# EAGLE design mbedshield060 (EAGLE 6.5.0)
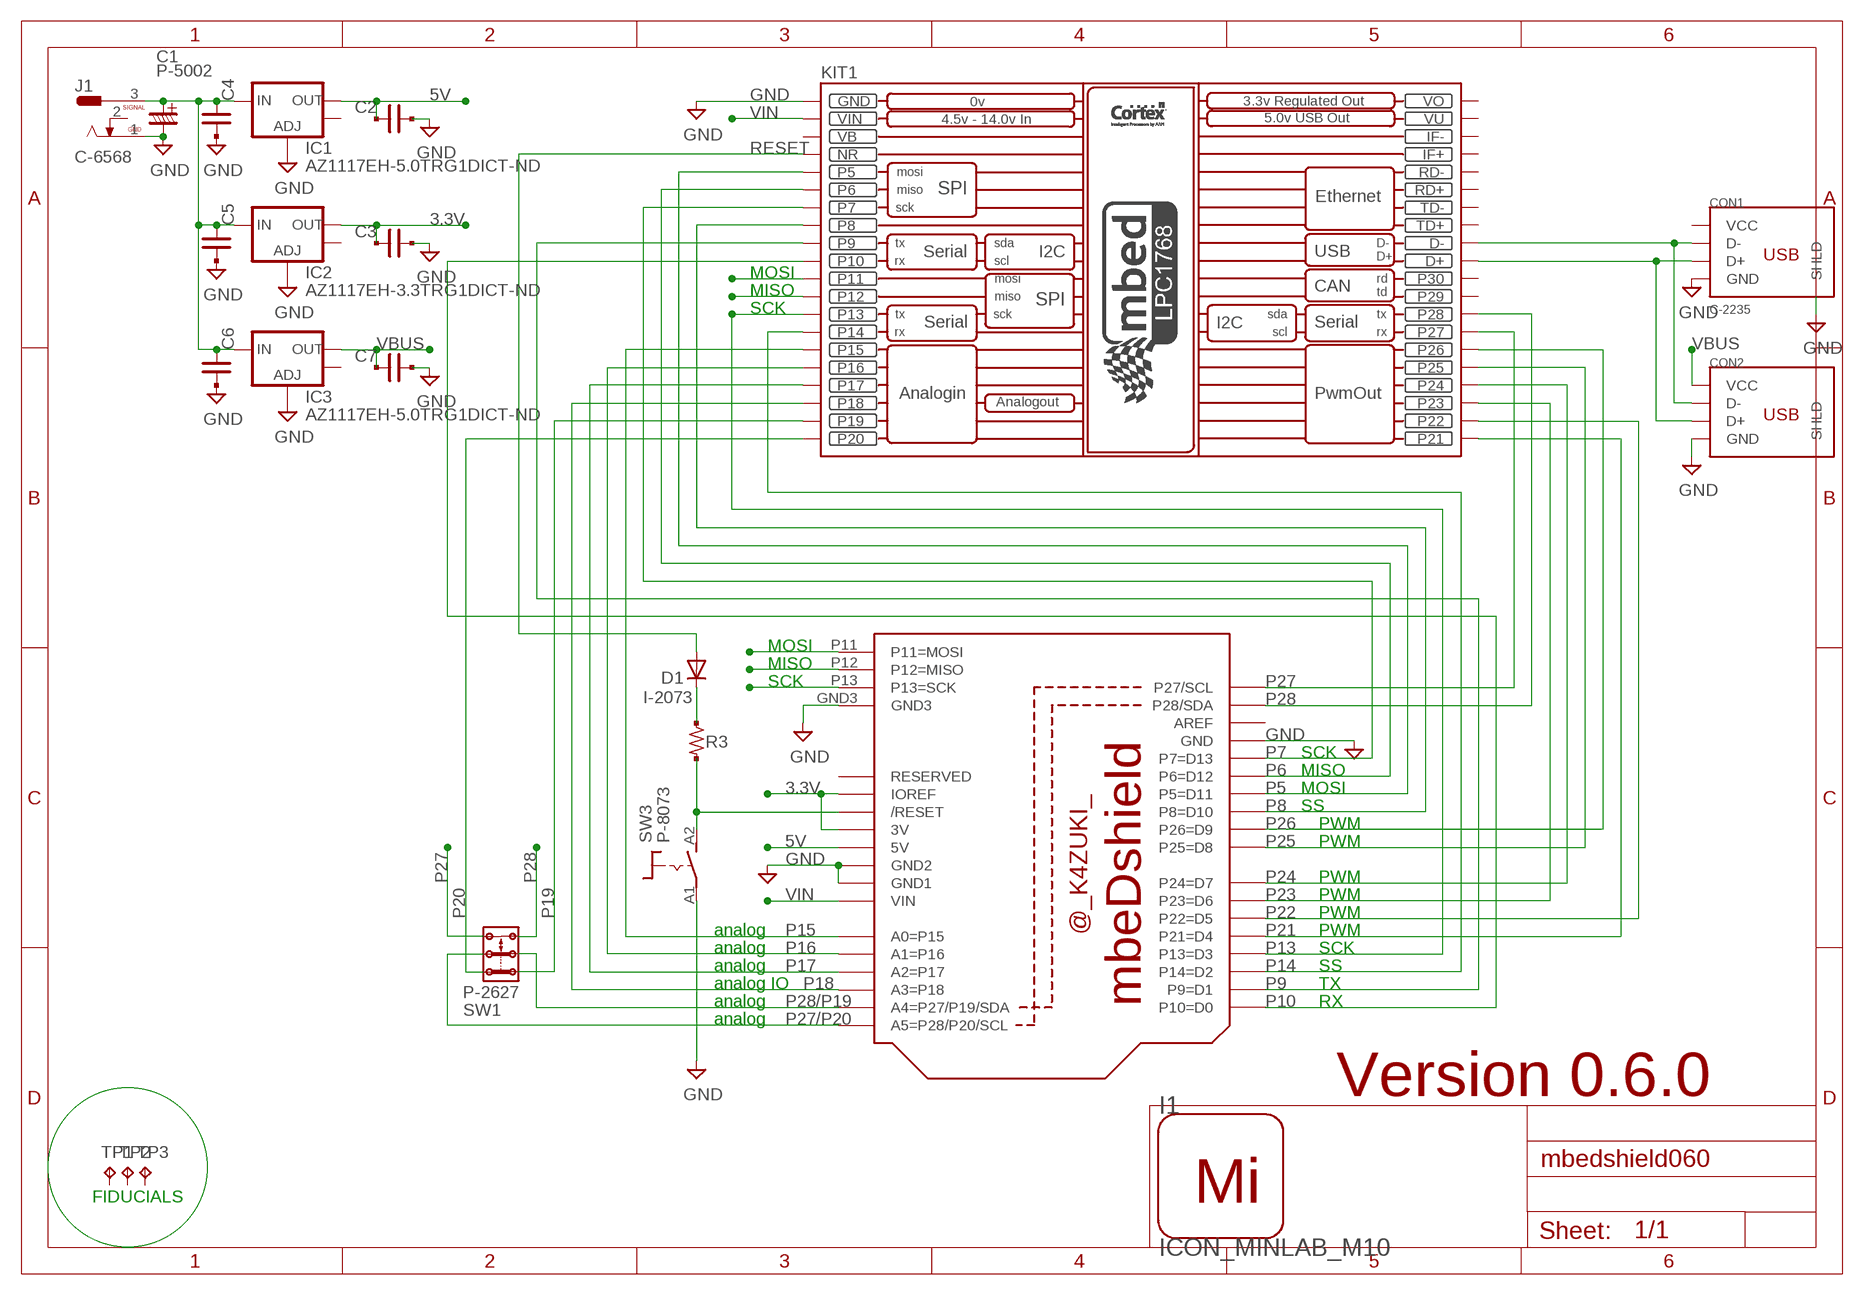
[diagram p0: schematic, sheet 1]

## Parts
C1  P-5002  C_DENKAI_2.5P6  [C_2.5PHI6]
C2  C_PAD_PAD_1608  [CR_1608]
C3  C_PAD_PAD_1608  [CR_1608]
C4  C_PAD_PAD_1608  [CR_1608]
C5  C_PAD_PAD_1608  [CR_1608]
C6  C_PAD_PAD_1608  [CR_1608]
C7  C_PAD_PAD_1608  [CR_1608]
CON1  C-2235  CON_USB  [CON_USB_MINIB_AKI]
CON2  CON_USB_A  [CON_USB_A_SHIELD]
D1  I-2073  DIODE_SMALL  [DIODE_2125]
I1  ICON_MINLAB_M10  [ICON_MINLAB_10MM]
IC1  AZ1117EH-5.0TRG1DICT-ND  V_REG_LM1117SOT223  [SOT223]
IC2  AZ1117EH-3.3TRG1DICT-ND  V_REG_LM1117SOT223  [SOT223]
IC3  AZ1117EH-5.0TRG1DICT-ND  V_REG_LM1117SOT223  [SOT223]
J1  C-6568  CON_DCJACK1  [CON_DCJACK]
KIT1  MBED_NXP_LPC1768  [MBED-KIT]
R3  R_US_PAD_PAD_1608  [R_1608_PADPAD]
SW1  P-2627  SW_SLIDESW_2_  [SW_SLIDE_2X2_1]
SW3  P-8073  SW_TACTSW_2PP8073  [SW_TACTSW_P8073]
TP1  TPTP20R  [TP20R]
TP2  TPTP20R  [TP20R]
TP3  TPTP20R  [TP20R]
U$1  mbeDshield060  BOARD_MBEDSHIELD3  [BOARD_MBEDSHIELD3]

## Nets
3.3V: C3.1 IC2.2(OUT) U$1.3V U$1.IOREF
5V: C2.1 IC1.2(OUT) U$1.5V
GND [power]: C1.- C2.2 C3.2 C4.2 C5.2 C6.2 C7.2 CON1.GND CON1.GND@1(SHLD) CON1.GND@2(SHLD) CON1.GND@3(SHLD) CON1.GND@4(SHLD) CON2.4(GND) IC1.1(ADJ) IC2.1(ADJ) IC3.1(ADJ) J1.1 KIT1.GND SW3.A1(P) U$1.GND U$1.GND1 U$1.GND2 U$1.GND3
N$1: CON1.D- CON2.2(D-) KIT1.D-
N$27: D1.K(C) R3.1
N$28: R3.2 SW3.A2(S) U$1.RESET(/RESET)
N$45: CON1.D+ CON2.3(D+) KIT1.D+
P5: KIT1.P$5(P5) U$1.D11(P5=D11)
P6: KIT1.P$6(P6) U$1.D12(P6=D12)
P7: KIT1.P$7(P7) U$1.D13(P7=D13)
P8: KIT1.P$8(P8) U$1.D10(P8=D10)
P9: KIT1.P$9(P9) U$1.D1(P9=D1)
P10: KIT1.P$10(P10) U$1.D0(P10=D0)
P11: KIT1.P$11(P11) U$1.P11(P11=MOSI)
P12: KIT1.P$12(P12) U$1.P12(P12=MISO)
P13: KIT1.P$13(P13) U$1.D3(P13=D3) U$1.P13(P13=SCK)
P14: KIT1.P$14(P14) U$1.D2(P14=D2)
P15: KIT1.P$15(P15) U$1.A0(A0=P15)
P16: KIT1.P$16(P16) U$1.A1(A1=P16)
P17: KIT1.P$17(P17) U$1.A2(A2=P17)
P18: KIT1.P$18(P18) U$1.A3(A3=P18)
P19: KIT1.P$19(P19) SW1.1.1
P20: KIT1.P$20(P20) SW1.1.2
P21: KIT1.P$21(P21) U$1.D4(P21=D4)
P22: KIT1.P$22(P22) U$1.D5(P22=D5)
P23: KIT1.P$23(P23) U$1.D6(P23=D6)
P24: KIT1.P$24(P24) U$1.D7(P24=D7)
P25: KIT1.P$25(P25) U$1.D8(P25=D8)
P26: KIT1.P$26(P26) U$1.D9(P26=D9)
P27: KIT1.P$27(P27) SW1.2.2 U$1.SCL(P27/SCL)
P27/P20: SW1.COM.2 U$1.A5(A5=P28/P20/SCL)
P28: KIT1.P$28(P28) SW1.2.1 U$1.SDA(P28/SDA)
P28/P19: SW1.COM.1 U$1.A4(A4=P27/P19/SDA)
RESET: D1.A KIT1.NR
VBUS: C7.1 CON2.1(VCC) IC3.2(OUT)
VIN [power]: C1.+ C4.1 C5.1 C6.1 IC1.3(IN) IC2.3(IN) IC3.3(IN) J1.3 KIT1.VIN U$1.VIN
Unconnected: CON1.VBUS(VCC) CON2.SHLD CON2.SHLD@1(SHLD) IC1.4(OUT) IC2.4(OUT) IC3.4(OUT) J1.2 KIT1.IF+ KIT1.IF- KIT1.P$29(P29) KIT1.P$30(P30) KIT1.RD+ KIT1.RD- KIT1.TD+ KIT1.TD- TP1.TP TP2.TP TP3.TP U$1.AREF U$1.RESERVED

## Notes on the sheet
- MOSI
- MISO
- SCK
- MOSI
- MISO
- SCK
- SCK
- MISO
- MOSI
- SS
- PWM
- PWM
- PWM
- PWM
- PWM
- analog | PWM
- analog | SCK
- analog | SS
- analog IO | TX
- analog | RX
- analog
- Version 0.6.0
- FIDUCIALS

## Power pins joined to a net without a drawn wire
VB: KIT1.VB
VO: KIT1.VOUT(VO)
VU: KIT1.VU

## Library data of the parts
C1 = mylib:C_DENKAI: (Device name) : (Main function of the device) Packages : (Variant name1) : (Pitch) x (Pin) x (Width) (Variant name2) : (Pitch) x (Pin) x (Width) (Variant name3) : (Pitch) x (Pin) x (Width) ...
C2-C7 = mylib:C_PAD_PAD_: SMD CAPACITOR : PAD - PAD
CON1 CON2 = mylib:CON_USB: USB B CONNECTOR
D1 = mylib:DIODE_SMALL: DIODE high speed (Philips)
I1 = mylib:ICON_MINLAB
IC1-IC3 = SparkFun:V_REG_LM1117: Voltage Regulator LM1117 Standard adjustable voltage regulator but in SMD form. Spark Fun Electronics SKU : COM-00595
J1 = mylib:CON_DCJACK: DC JACK : 2.1 / 2.5 mm
KIT1 = MBED_v2.1:MBED_NXP_LPC1768: Mbed LPC1768 - ARM CORTEX v2.1 * Schematic symbol is now placed in eagles's default raster. *The pads diameter are suitable for routing between mbed pins * mbed pads are 0.8 mm drill diameter. --------------------------------------------- Created by: Mohamed Yousry *Alexandria, Egypt *Email: mohamed.yousry@ieeegoldegypt.org
R3 = mylib:R_US_PAD_PAD: R_US_PAD_PAD : SMD R PAD is NTH-NTH Packages : _1608 : 1.6 x 0.8 mm _2125 : 2.0 x 1.25 mm _3216 : 3.2 x 1.6 mm
SW1 = mylib:SW_SLIDESW_2_
SW3 = mylib:SW_TACTSW_2P
TP1-TP3 = testpad_local:TP: Test pad
U$1 = mylib:BOARD_MBEDSHIELD3

## Net classes
0 signal: width 0.406 mm, drill 0.3 mm
1 power: width 0.254 mm, drill 0.3 mm

## Board
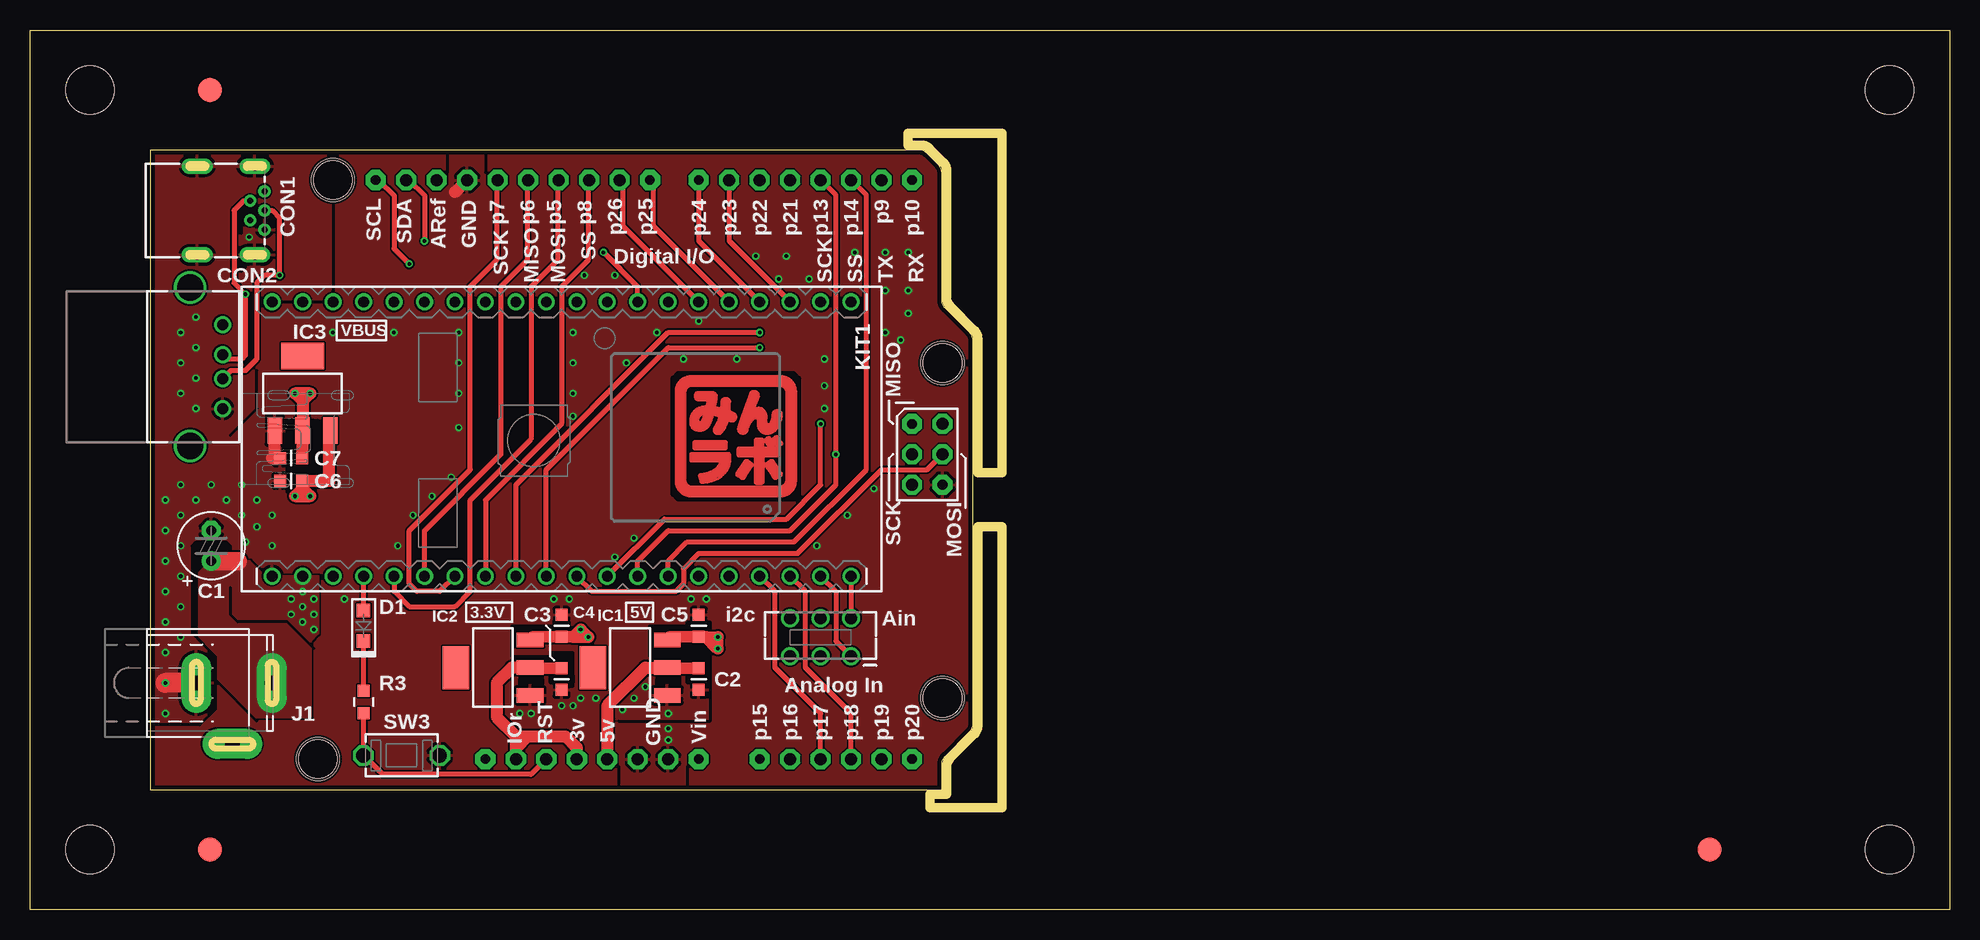
[diagram p1: board, top side]
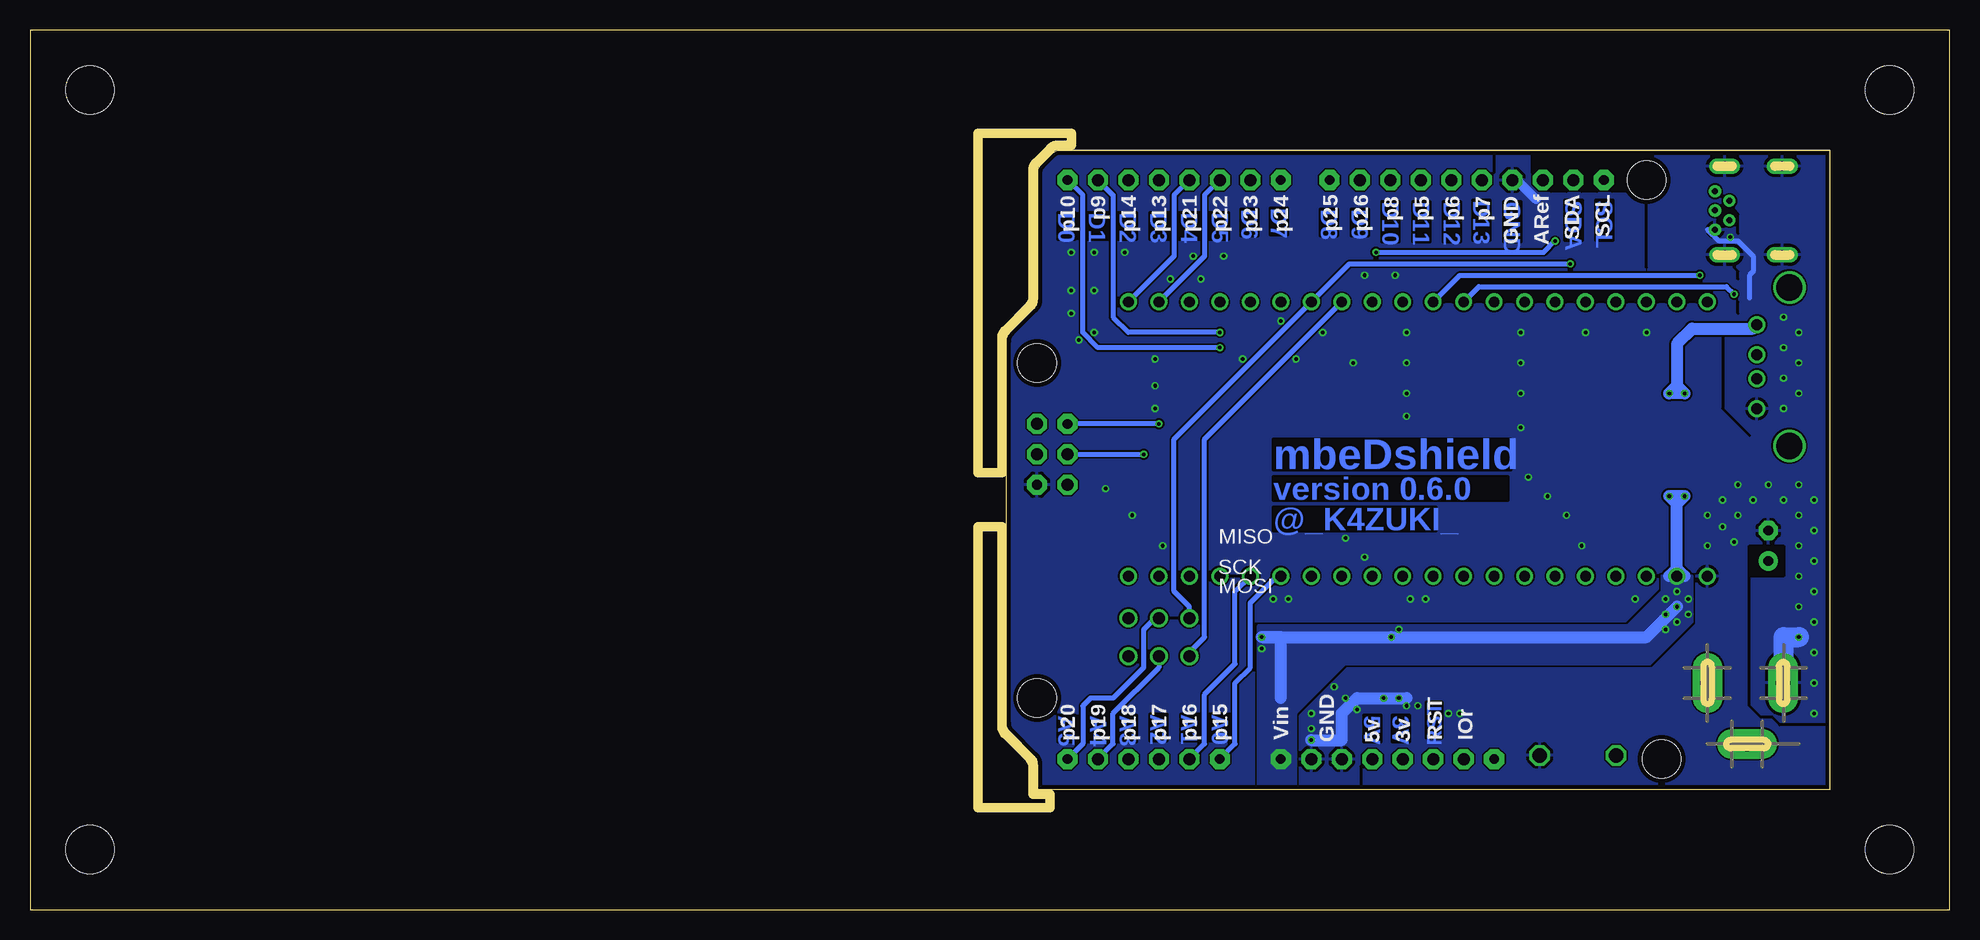
[diagram p2: board, bottom side, seen from below]

Size 160 x 73.3 mm. Coordinates in mm from the lower left corner, seen from the top.
Outline: 0,0 0,73.3 160,73.3 160,0 0,0
Outline: 10,63.3 10,10 76,10 76,12.09 arc-45 76.29,12.79 78.31,14.81 arc45 78.6,15.51 78.6,47.39 arc45 78.31,48.09 76.29,50.11 arc-45 76,50.81 76,61.39 arc45 75.71,62.09 74.79,63.01 arc45 74.09,63.3 10,63.3
Copper layers (1*16): Top 0.0356mm / dielectric 1.5011mm / Bottom 0.0356mm
Design rules "default *": minimum track width 0.15mm, minimum drill 0.3mm, track to track 0.15mm, track to pad 0.15mm, pad to pad 0.15mm, via to via 0.15mm, smd to smd 0mil, copper to edge 15mil, drill to drill 8mil, minimum pad ring 10mil, minimum via ring 0.15mm, stop-mask expansion 4mil, vias tented up to drill 100mil, thermal gap 10mil
Holes 3.2 mm at 76.06,45.56 76.06,17.62 23.99,12.54 25.26,60.8
Holes 4 mm at 5,5 5,68.3 155,5 155,68.3
tRestrict: area 43.4,18.9 to 45.3,19.5; area 54.8,18.9 to 56.7,19.5; area 40.8,18.9 to 42.7,19.2; area 52.2,18.9 to 54.2,19.2; area 54.8,23.3 to 56.7,24; area 43.7,23.3 to 44.9,24; area 21.4,38.9 to 21.8,40.8; area 23.7,38.9 to 24,40.8; area 21.4,36.7 to 22.1,38.6; area 21.4,34.8 to 22.1,36.7; 40 lines
bRestrict: 36 lines
Milling: area 75,8.5 to 81,31.9; area 73.2,36.4 to 81,64.7

### Footprints (pad centres in the part's own frame; a part is rotated, then mirrored left to right if it is on the bottom)
C_2.5PHI6 = drill 0.813 pad 1.6: + -1.27,0 | drill 0.813 pad 1.6 octagon: - 1.27,0
CR_1608 = smd 1 x 1: 1 -0.9,0; 2 0.9,0
CON_USB_MINIB_AKI = drill 0.5: D+ 0,0; D- -1.2,0.8; GND 0,-1.6; ID -1.2,-0.8; VBUS 0,1.6 | drill 0.8 long: GND@1 -5.6,3.7; GND@2 -0.8,3.7; GND@3 -0.8,-3.7; GND@4 -5.6,-3.7
CON_USB_A_SHIELD = drill 0.9: 1 -3.5,0; 2 -1,0; 3 1,0; 4 3.5,0 | drill 2.2: SHLD -6.6,-2.7; SHLD@1 6.6,-2.7
DIODE_2125 = smd 1.143 x 1.143: A 1.27,0; K -1.27,0
SOT223 = smd 1.219 x 2.235: 1 -2.311,-3.099; 2 0,-3.099; 3 2.311,-3.099 | smd 3.6 x 2.2: 4 0,3.099
CON_DCJACK = drill 1.2 pad 2.5 long: 1 -0.6,0; 2 2.405,-5.08; 3 5.7,0
MBED-KIT = drill 0.9: D+ 11.43,1.27; D- 11.43,3.81; GND -11.43,24.13; IF+ 11.43,16.51; IF- 11.43,19.05; NR -11.43,16.51; P$5 -11.43,13.97; P$6 -11.43,11.43; P$7 -11.43,8.89; P$8 -11.43,6.35; P$9 -11.43,3.81; P$10 -11.43,1.27; P$11 -11.43,-1.27; P$12 -11.43,-3.81; P$13 -11.43,-6.35; P$14 -11.43,-8.89; P$15 -11.43,-11.43; P$16 -11.43,-13.97; P$17 -11.43,-16.51; P$18 -11.43,-19.05; P$19 -11.43,-21.59; P$20 -11.43,-24.13; P$21 11.43,-24.13; P$22 11.43,-21.59; P$23 11.43,-19.05; P$24 11.43,-16.51; P$25 11.43,-13.97; P$26 11.43,-11.43; P$27 11.43,-8.89; P$28 11.43,-6.35; P$29 11.43,-3.81; P$30 11.43,-1.27; RD+ 11.43,11.43; RD- 11.43,13.97; TD+ 11.43,6.35; TD- 11.43,8.89; VB -11.43,19.05; VIN -11.43,21.59; VOUT 11.43,24.13; VU 11.43,21.59
R_1608_PADPAD = smd 1 x 1: 1 -0.953,0; 2 0.953,0
SW_SLIDE_2X2_1 = drill 0.991: 1.1 -2.54,1.587; 1.2 -2.54,-1.587; 2.1 2.54,1.575; 2.2 2.54,-1.587; COM.1 0,1.575; COM.2 0,-1.587
SW_TACTSW_P8073 = drill 1.2 octagon: A1 -3.175,0; A2 3.175,0
TP20R = smd 2 x 2: TP 0,0
BOARD_MBEDSHIELD3 = drill 1 pad 1.676 octagon: 3V 35.56,2.54; 5V 38.1,2.54; A1 53.34,2.54; A2 55.88,2.54; A3 58.42,2.54; A4 60.96,2.54; AREF 23.876,50.8; D1 60.96,50.8; D2 58.42,50.8; D3 55.88,50.8; D4 53.34,50.8; D5 50.8,50.8; D6 48.26,50.8; D9 39.116,50.8; D10 36.576,50.8; D11 34.036,50.8; D12 31.496,50.8; D13 28.956,50.8; D15 66.04,30.48; D18 63.5,25.4; GND 26.416,50.8; GND1 43.18,2.54; GND2 40.64,2.54; IOREF 30.48,2.54; P11 66.04,27.94; P13 63.5,27.94; RESET 33.02,2.54; SDA 21.336,50.8 | drill 0.8 pad 1.676 octagon: A0 50.8,2.54; A5 63.5,2.54; D0 63.5,50.8; D7 45.72,50.8; D8 41.656,50.8; GND3 66.04,25.4; P12 63.5,30.48; RESERVED 27.94,2.54; SCL 18.796,50.8; VIN 45.72,2.54

### Placement (x,y rotation side)
C1  15.1,30.32 90 top
C2  55.74,19.21 270 top
C3  44.31,19.21 270 top
C4  44.31,23.65 90 top
C5  55.74,23.65 90 top
C6  21.77,35.72 180 top
C7  21.77,37.62 180 top
CON1  19.55,58.26 0 top
CON2  16.05,45.24 270 top
D1  27.8,23.65 90 top
I1  53.84,34.45 0 top
IC1  50.02,20.16 90 top
IC2  38.59,20.16 90 top
IC3  22.72,43.02 0 top
J1  14.46,18.89 0 top
KIT1  44.31,39.21 90 top
R3  27.8,17.3 270 top
SW1  65.9,22.7 180 top
SW3  30.98,12.86 180 top
TP1  15,68.3 0 top
TP2  140,5 0 top
TP3  15,5 0 top
U$1  10.02,10 0 top

### Tracks (layer width: path | path; a pad name or v marks a point on that pad's centre or on a via)
3.3V
  Top 1.016: 40.5,14.45 38.91,16.03 38.91,18.89 40.18,20.16 IC2.2 C3.1 | 40.5,14.45 41.45,14.45 | 41.45,14.45 44.63,14.45 45.58,13.49 U$1.3V | U$1.IOREF 40.5,13.49 | 40.5,13.49 40.5,14.45 | 41.45,14.45 40.5,13.49
5V
  Top 1.016: U$1.5V 48.12,16.98 51.3,20.16 IC1.2 C2.1
GND  (via drill 0.3)
  Top 0.254: 20.41,37.62 C7.2
  Top 1.016: 35.42,59.78 U$1.GND | 20.18,37.62 20.41,37.62 IC3.1
  Top 1.676: J1.1 v11.29,18.89
  Bottom 0.406: CON1.GND 20.17,56.66 19.23,55.72 17.64,55.72 16.37,54.45 16.37,53.18 16.69,52.86 16.69,50.96
  Bottom 0.813: 36.05,60.8 34.47,59.21
  Bottom 1.016: 45.26,17.62 49.39,17.62 50.66,16.35 50.66,14.13 v53.2,14.13 | 36.37,60.8 36.05,60.8
  Bottom 1.676: J1.1 13.83,22.7 v12.56,22.7
  other vias: 33.52,34.45 35.74,43.02 25.26,48.1 46.22,52.86 12.56,43.02 17.64,35.4 20.18,32.86 30.66,30.32 17.96,30.64 41.77,16.35 53.2,16.35 12.56,45.56 12.56,48.1 11.29,26.51 11.29,23.97 18.27,56.04 50.34,17.62 26.21,25.88 12.56,30.32 12.56,27.78 11.29,29.05 12.56,25.24 11.29,21.43 11.29,16.35 18.91,34.13 17.64,32.86 12.56,35.4 13.83,41.75 13.83,44.29 13.83,46.83 13.83,49.37 31.93,32.86 45.26,45.56 12.56,32.86 11.29,31.59 47.17,17.62 40.82,16.35 44.31,16.98 30.34,48.1 35.74,48.1 45.26,48.1 66.22,45.88 44.95,25.88 56.38,25.88 51.3,18.57 45.9,17.62 55.1,25.88 43.67,25.88 45.26,16.98 18.91,31.91 20.18,30.32 53.2,15.08 11.29,34.13 16.37,34.13 13.83,34.13 15.1,35.4 35.1,36.03 49.39,16.67 35.74,45.56 45.26,43.02 35.74,40.16 45.26,41.12 49.71,45.56 55.74,49.05 58.91,45.88 66.22,41.75 66.22,43.66 65.58,30.32 68.12,32.86 70.34,35.08 48.76,29.37 50.34,30.95 54.47,45.88 52.25,48.1 48.76,52.86 72.57,47.47 73.2,49.69 73.2,51.59 71.3,48.1 71.3,51.59 73.2,54.77 71.3,54.77 68.76,54.77 64.95,52.55 63.04,54.45 62.41,52.55 60.5,54.45
  pour Top (rank 3): 10.02,63.34 78.6,63.34 78.6,10 10.02,10
  pour Bottom (rank 6): 10.02,63.34 78.6,63.34 78.6,10 10.02,10
N$1  (via drill 0.3)
  Top 0.406: CON1.D- 17.8,59.06 17,58.26 17,52.23 v17.96,51.27 17.96,46.2 17.64,45.88 16.42,45.88 CON2.2
  Bottom 0.406: KIT1.D- 39.23,51.91 18.59,51.91 v17.96,51.27
N$27
  Top 0.406: R3.1 D1.K
N$28
  Top 0.406: U$1.RESET 41.77,11.27 29.39,11.27 SW3.A2 R3.2
N$45  (via drill 0.3)
  Top 0.406: CON1.D+ 20.18,58.26 20.82,57.62 v20.82,52.86 19.55,52.86 18.91,52.23 18.91,45.88 17.96,44.92 16.73,44.92 CON2.3
  Bottom 0.406: KIT1.D+ 40.82,52.86 v20.82,52.86
P5
  Top 0.406: KIT1.P$5 30.34,26.51 31.61,25.24 35.42,25.24 36.69,26.51 36.69,34.13 41.77,39.21 41.77,51.91 43.99,54.13 43.99,60.8 U$1.D11
P6
  Top 0.406: KIT1.P$6 32.88,31.59 39.23,37.94 39.23,51.91 41.45,54.13 41.45,60.8 U$1.D12
P7
  Top 0.406: KIT1.P$7 34.15,26.51 32.24,26.51 31.61,27.14 31.61,31.59 36.69,36.67 36.69,51.91 38.91,54.13 38.91,60.8 U$1.D13
P8
  Top 0.406: KIT1.P$8 37.96,34.13 44.31,40.48 44.31,51.91 46.53,54.13 46.53,60.8 U$1.D10
P9  (via drill 0.3)
  Top 0.406: KIT1.P$9 40.5,35.4 53.2,48.1 v60.82,48.1
  Bottom 0.406: U$1.D1 69.71,59.53 69.71,49.37 68.44,48.1 v60.82,48.1
P10  (via drill 0.3)
  Top 0.406: KIT1.P$10 43.04,36.67 53.2,46.83 v60.82,46.83
  Bottom 0.406: v60.82,46.83 70.98,46.83 72.25,48.1 72.25,59.53 U$1.D0
P11
  Top 0.406: KIT1.P$11 46.85,26.51 53.84,26.51 54.47,27.14 54.47,28.41 55.74,29.68 63.99,29.68 70.98,36.67 74.79,36.67 U$1.P11
P12  (via drill 0.3)
  Top 0.406: KIT1.P$12 52.88,32.54 63.04,32.54 65.9,35.4 v65.9,40.48
  Bottom 0.406: v65.9,40.48 U$1.P12
P13  (via drill 0.3)
  Top 0.406: U$1.D3 67.17,59.53 v67.17,37.94 67.17,35.4 63.36,31.59 53.2,31.59 50.66,29.05 KIT1.P$13
  Bottom 0.406: U$1.P13 v67.17,37.94
P14
  Top 0.406: U$1.D2 69.71,59.53 69.71,36.67 63.68,30.64 54.79,30.64 53.2,29.05 KIT1.P$14
P15
  Bottom 0.406: KIT1.P$15 56.06,27.78 58.28,25.56 58.28,20.16 59.55,18.89 59.55,13.81 U$1.A0
P16
  Bottom 0.406: KIT1.P$16 59.55,26.51 59.55,20.48 62.09,17.94 62.09,13.81 U$1.A1
P17
  Top 0.406: KIT1.P$17 62.09,26.51 62.09,20.16 65.9,16.35 U$1.A2
P18
  Top 0.406: KIT1.P$18 64.63,26.51 64.63,20.16 68.44,16.35 U$1.A3
P19
  Top 0.406: KIT1.P$19 67.17,26.51 67.17,22.38 SW1.1.1
P20
  Top 0.406: KIT1.P$20 SW1.1.2
P21
  Bottom 0.406: U$1.D4 64.63,59.53 64.63,54.45 KIT1.P$21
P22
  Bottom 0.406: U$1.D5 62.09,59.53 62.09,54.45 KIT1.P$22
P23
  Top 0.406: U$1.D6 58.28,55.72 KIT1.P$23
P24
  Top 0.406: U$1.D7 55.74,55.72 KIT1.P$24
P25
  Top 0.406: U$1.D8 51.93,60.55 51.93,56.99 KIT1.P$25
P26
  Top 0.406: U$1.D9 49.39,60.55 49.39,56.99 KIT1.P$26
P27  (via drill 0.3)
  Top 0.406: U$1.SCL 29.07,60.8 30.34,59.53 30.34,55.09 v31.61,53.81
  Bottom 0.406: SW1.2.2 63.36,25.24 64.63,26.51 64.63,39.21 KIT1.P$27 50.02,53.81 v31.61,53.81
P27/P20
  Bottom 0.406: SW1.COM.2 66.22,24.29 67.17,23.34 67.17,20.16 69.71,17.62 71.61,17.62 72.25,16.98 72.25,13.81 U$1.A5
P28  (via drill 0.3)
  Top 0.406: KIT1.P$28 50.66,51.91 v47.8,54.77 | U$1.SDA 31.61,60.8 32.88,59.53 v32.88,55.72
  Bottom 0.406: SW1.2.1 63.36,21.43 62.09,22.7 62.09,39.21 KIT1.P$28 | v47.8,54.77 33.83,54.77 v32.88,55.72
P28/P19
  Bottom 0.406: SW1.COM.1 65.9,20.16 69.71,16.35 69.71,13.81 U$1.A4
RESET
  Top 0.406: D1.A KIT1.NR
VBUS  (via drill 0.3)
  Top 1.016: 22.72,42.38 v22.09,43.02 v23.36,43.02 22.72,42.38 | 22.72,42.38 IC3.2 C7.1
  Bottom 1.016: 22.72,43.66 22.72,47.15 21.45,48.42 16.38,48.42 CON2.1 | 22.72,43.66 v22.09,43.02 v23.36,43.02 22.72,43.66
VIN  (via drill 0.3)
  Top 1.016: 56.38,22.7 C5.1 53.35,22.7 IC1.3 | 56.38,22.7 v57.33,22.7 v57.33,21.75 56.38,22.7 | 45.9,22.7 v46.53,22.7 v45.9,23.34 | 45.9,22.7 45.26,22.7 | 45.26,22.7 C4.1 41.92,22.7 IC2.3 | v45.9,23.34 45.9,22.7 | IC3.3 24.94,39.83 24.94,35.72 C6.1 22.72,35.08 | 22.72,35.08 v22.09,34.45 v23.36,34.45 22.72,35.08 | v45.9,23.34 45.26,22.7
  Top 1.524: 17.32,29.05 C1.+
  Bottom 1.016: 55.74,17.62 55.74,22.7 v57.33,22.7 v46.53,22.7 25.26,22.7 v22.72,25.24 | KIT1.VIN 22.72,28.41 | 22.72,28.41 22.72,33.81 | 22.72,33.81 v22.09,34.45 v23.36,34.45 22.72,33.81 | 22.72,28.41 22.09,27.78 23.36,27.78 22.72,28.41
  other vias: 22.72,26.51 21.77,25.88 21.77,24.61 22.72,23.97 23.67,23.34 23.67,25.88 23.67,24.61
  pour Top (rank 2, no thermals): 14.15,28.1 15.1,29.05 18.27,29.05 19.55,27.78 23.99,27.78 23.99,23.02 23.36,22.38 23.36,16.03 14.15,16.03
  pour Bottom (no thermals): 21.45,27.78 23.99,27.78 23.99,26.51 26.85,23.65 57.65,23.65 57.65,10 54.47,10 54.47,16.35 50.34,20.48 24.94,20.48 21.45,23.97

### Text on the board
Bottom: SCL | SDA | GND | D13 | D12 | D11 | D10 | D9 | D8 | D7 | D6 | D5 | D4 | D3 | D2 | D1 | D0 | mbeDshield | version 0.6.0 | @_K4ZUKI_ | RST | 3V | 5V | A0 | A1 | A2 | A3 | A4 | A5
tPlace: SS | SCK | MISO | MOSI | SCK | SS | TX | RX | VBUS | MISO | SCK | MOSI | 3.3V | 5V | i2c | Ain
bPlace: MISO | SCK | MOSI